# EAGLE design Board (EAGLE 6.6.0)
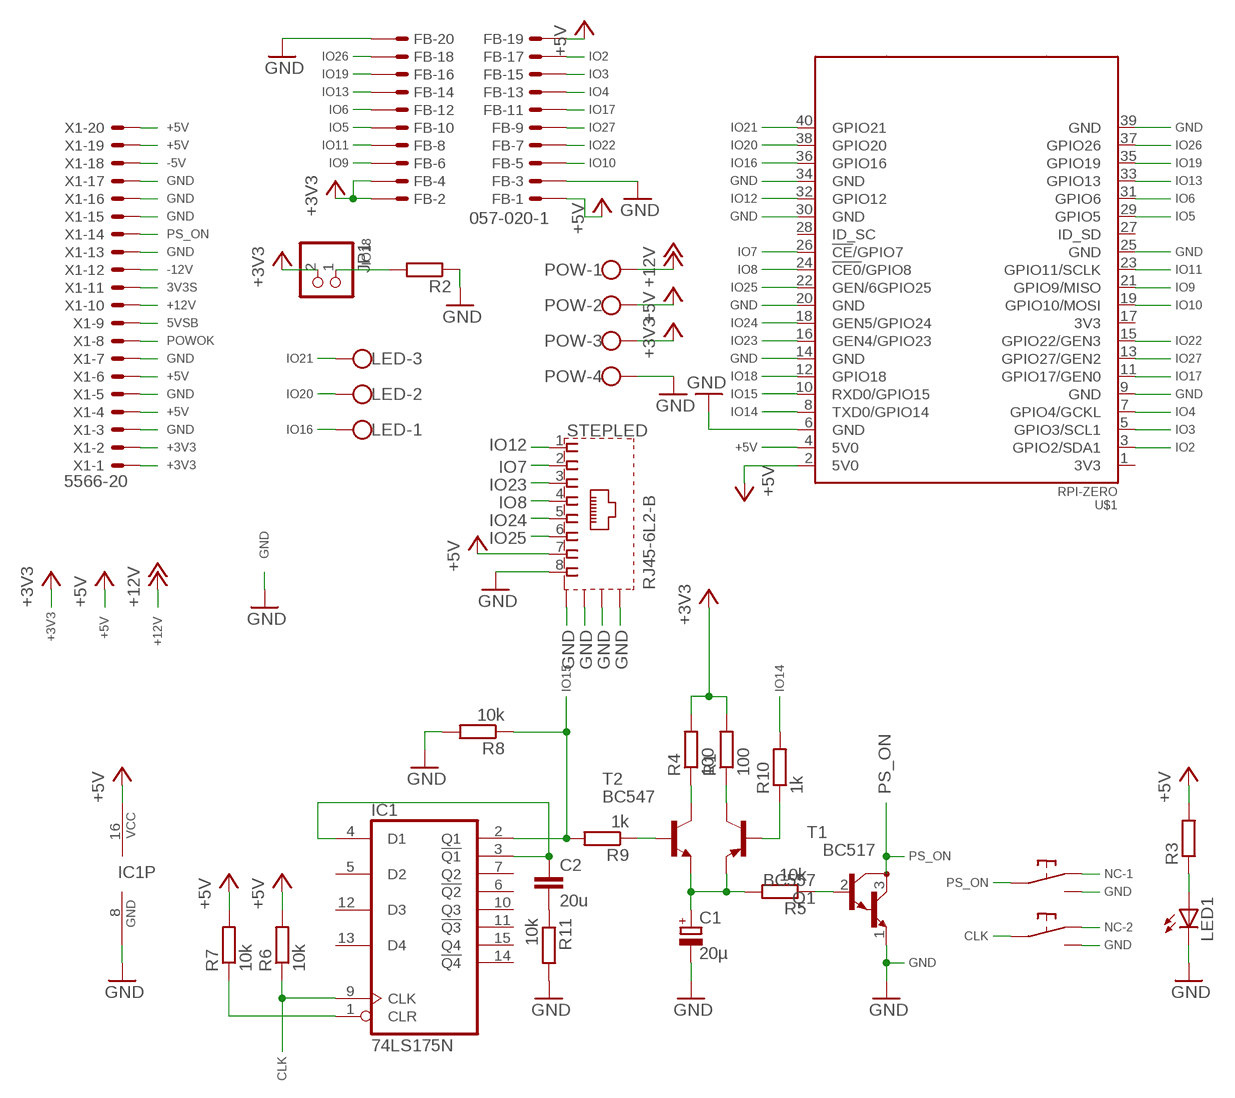
[diagram p0: schematic, sheet 1]

## Parts
C1  20µ  CPOL-EUE2,5-6E  [E2,5-6E]
C2  20u  C-EU050-024X044  [C050-024X044]
FB  057-020-1  [057-020-1]
IC1  74LS175N  [DIL16]
JP1  PINHD-1X2  [1X02]
LED  W237-103  [W237-103]
LED1  LED3MM  [LED3MM]
POW  W237-4  [W237-4]
Q1  BC557  [TO92]
R1  100  R-EU_0204/7  [0204/7]
R2  R-EU_0204/7  [0204/7]
R3  R-EU_0204/5  [0204/5]
R4  100  R-EU_0204/7  [0204/7]
R5  10k  R-EU_0204/7  [0204/7]
R6  10k  R-EU_0204/7  [0204/7]
R7  10k  R-EU_0204/7  [0204/7]
R8  10k  R-EU_0204/7  [0204/7]
R9  1k  R-EU_0204/7  [0204/7]
R10  1k  R-EU_0204/7  [0204/7]
R11  10k  R-EU_0204/7  [0204/7]
STEPLED  RJ45-6L2-B  [RJ45-SHIELD2]
T1  BC517  [TO92]
T2  BC547  [TO92]
U$1  RPI-ZERO  [RASPBERRYPI_BASTELSTUBE_V13_RASPI_BOARD_B+_FULL]
U$2  PC-SWITCH  [PC-SWITCH]
X1  5566-20  [5566-20]

## Nets
3V3S: X1.11
5VSB: X1.9
+3V3: FB.2 FB.4 JP1.2 POW.3 R1.2 R4.2 X1.1 X1.2
+5V: FB.1 FB.19 IC1.16(VCC) POW.2 R3.2 R6.2 R7.2 STEPLED.7 U$1.2(5V0) U$1.4(5V0) X1.4 X1.6 X1.19 X1.20
+12V: POW.1 X1.10
-5V: X1.18
-12V: X1.12
CLK: IC1.9(CLK) R6.1 U$2.COM$5
CLR: IC1.1(CLR) R7.1
GND: C1.- FB.3 FB.20 IC1.8(GND) LED1.K(C) POW.4 R2.1 R8.2 R11.2 STEPLED.8 STEPLED.S1(S) STEPLED.S2(S) STEPLED.S3(S) STEPLED.S4(S) T1.1(E) U$1.6(GND) U$1.9(GND) U$1.14(GND) U$1.20(GND) U$1.25(GND) U$1.30(GND) U$1.34(GND) U$1.39(GND) U$2.NO$3 U$2.NO$6 X1.3 X1.5 X1.7 X1.13 X1.15 X1.16 X1.17
IO2: FB.17 U$1.3(GPIO2/SDA1)
IO3: FB.15 U$1.5(GPIO3/SCL1)
IO4: FB.13 U$1.7(GPIO4/GCKL)
IO5: FB.10 U$1.29(GPIO5)
IO6: FB.12 U$1.31(GPIO6)
IO7: STEPLED.2 U$1.26(!CE!/GPIO7)
IO8: STEPLED.4 U$1.24(!CE0!/GPIO8)
IO9: FB.6 U$1.21(GPIO9/MISO)
IO10: FB.5 U$1.19(GPIO10/MOSI)
IO11: FB.8 U$1.23(GPIO11/SCLK)
IO12: STEPLED.1 U$1.32(GPIO12)
IO13: FB.14 U$1.33(GPIO13)
IO14: R10.2 U$1.8(TXD0/GPIO14)
IO15: IC1.2(Q1) R8.1 R9.2 U$1.10(RXD0/GPIO15)
IO16: LED.1 U$1.36(GPIO16)
IO17: FB.11 U$1.11(GPIO17/GEN0)
IO18: JP1.1 R2.2 U$1.12(GPIO18)
IO19: FB.16 U$1.35(GPIO19)
IO20: LED.2 U$1.38(GPIO20)
IO21: LED.3 U$1.40(GPIO21)
IO22: FB.7 U$1.15(GPIO22/GEN3)
IO23: STEPLED.3 U$1.16(GEN4/GPIO23)
IO24: STEPLED.5 U$1.18(GEN5/GPIO24)
IO25: STEPLED.6 U$1.22(GEN/6GPIO25)
IO26: FB.18 U$1.37(GPIO26)
IO27: FB.9 U$1.13(GPIO27/GEN2)
N$1: C2.2 R11.1
N$2: R4.1 T2.3(C)
N$3: Q1.3(C) R1.1
N$4: Q1.2(B) R10.1
N$19: LED1.A R3.1
N$20: C2.1 IC1.3(!Q1) IC1.4(D1)
N$21: R9.1 T2.2(B)
N$23: R5.1 T1.2(B)
N$24: C1.+ Q1.1(E) R5.2 T2.1(E)
NC-1: U$2.NC$1
NC-2: U$2.NC$4
POWOK: X1.8
PS_ON: T1.3(C) U$2.COM$2 X1.14
Unconnected: IC1.5(D2) IC1.6(!Q2) IC1.7(Q2) IC1.10(Q3) IC1.11(!Q3) IC1.12(D3) IC1.13(D4) IC1.14(!Q4) IC1.15(Q4) U$1.1(3V3) U$1.17(3V3) U$1.27(ID_SD) U$1.28(ID_SC)

## Library data of the parts
C1 = rcl:CPOL-EU: POLARIZED CAPACITOR, European symbol
C2 = rcl:C-EU: CAPACITOR, European symbol
FB = con-panduit:057-020-: CONNECTOR 20-pin series 057 contact pc board low profile headers; OC_FARNELL: unknown; OC_NEWARK: unknown
IC1 = 74xx-us:74*175: Qadruple D type FLIP FLOP, clear
JP1 = pinhead:PINHD-1X2: PIN HEADER
LED = con-wago-500:W237-103: WAGO SCREW CLAMP; MPN: 237-103; OC_FARNELL: unknown; OC_NEWARK: 18M7116
LED1 = led:LED: LED OSRAM: - CHIPLED LG R971, LG N971, LY N971, LG Q971, LY Q971, LO R971, LY R971 LH N974, LH R974 LS Q976, LO Q976, LY Q976 LO Q996 - Hyper CHIPLED LW Q18S LB Q993, LB Q99A, LB R99A - SideLED LS A670, LO A670, LY A670, LG A670, LP A670 LB A673, LV A673, LT A673, LW A673 LH A674 LY A675 LS A676, LA A676, LO A676, LY A676, LW A676 LS A679, LY A679, LG A679 - Hyper Micro SIDELED® LS Y876, LA Y876, LO Y876, LY Y876 LT Y87S - SmartLED LW L88C, LW L88S LB L89C, LB L89S, LG L890 LS L89K, LO L89K, LY L89K LS L896, LA L896, LO L896, LY L896 - TOPLED LS T670, LO T670, LY T670, LG T670, LP T670 LSG T670, LSP T670, LSY T670, LOP T670, LYG T670 LG T671, LOG T671, LSG T671 LB T673, LV T673, LT T673, LW T673 LH T674 LS T676, LA T676, LO T676, LY T676, LB T676, LH T676, LSB T676, LW T676 LB T67C, LV T67C, LT T67C, LS T67K, LO T67K, LY T67K, LW E67C LS E67B, LA E67B, LO E67B, LY E67B, LB E67C, LV E67C, LT E67C LW T67C LS T679, LY T679, LG T679 LS T770, LO T770, LY T770, LG T770, LP T770 LB T773, LV T773, LT T773, LW T773 LH T774 LS E675, LA E675, LY E675, LS T675 LS T776, LA T776, LO T776, LY T776, LB T776 LHGB T686 LT T68C, LB T68C - Hyper Mini TOPLED® LB M676 - Mini TOPLED Santana® LG M470 LS M47K, LO M47K, LY M47K Source: http://www.osram.convergy.de LUXEON: - LUMILED® LXK2-PW12-R00, LXK2-PW12-S00, LXK2-PW14-U00, LXK2-PW14-V00 LXK2-PM12-R00, LXK2-PM12-S00, LXK2-PM14-U00 LXK2-PE12-Q00, LXK2-PE12-R00, LXK2-PE12-S00, LXK2-PE14-T00, LXK2-PE14-U00 LXK2-PB12-K00, LXK2-PB12-L00, LXK2-PB12-M00, LXK2-PB14-N00, LXK2-PB14-P00, LXK2-PB14-Q00 LXK2-PR12-L00, LXK2-PR12-M00, LXK2-PR14-Q00, LXK2-PR14-R00 LXK2-PD12-Q00, LXK2-PD12-R00, LXK2-PD12-S00 LXK2-PH12-R00, LXK2-PH12-S00 LXK2-PL12-P00, LXK2-PL12-Q00, LXK2-PL12-R00 Source: www.luxeon.com KINGBRIGHT: KA-3528ASYC Source: www.kingbright.com
POW = con-wago-500:W237-4: WAGO SCREW CLAMP; OC_FARNELL: unknown; OC_NEWARK: unknown
Q1 = transistor-pnp:BC557: PNP Transistor
R1-R11 = resistor:R-EU_: RESISTOR, European symbol
STEPLED = con-tycoelectronics:RJ45*2: RJ45 Low Profile Shield Type 2 For all RJ45 L, LC, LCT and X Series Models Source: www.tycoelectronics.com .. ENG_DS_1654001_1099_RJ_L_0507.pdf; MPN: RJ45-6L2-B; OC_FARNELL: unknown; OC_NEWARK: 16R6096
T1 = transistor:BC517: NPN BIPOLAR DARLINGTON TRANSISTOR
T2 = transistor:BC547: NPN TRANSISTOR
U$1 = RPI-Zero:RPI-ZERO
U$2 = pc-switch:PC-SWITCH: PC-Switch with two electricly seperated pushbuttons
X1 = con-molex:5566-20: Mini FIT connector 20 pol ATX PC-Motherboard Power connector Source: http://www.molex.com; OC_FARNELL: unknown; OC_NEWARK: unknown

## Board
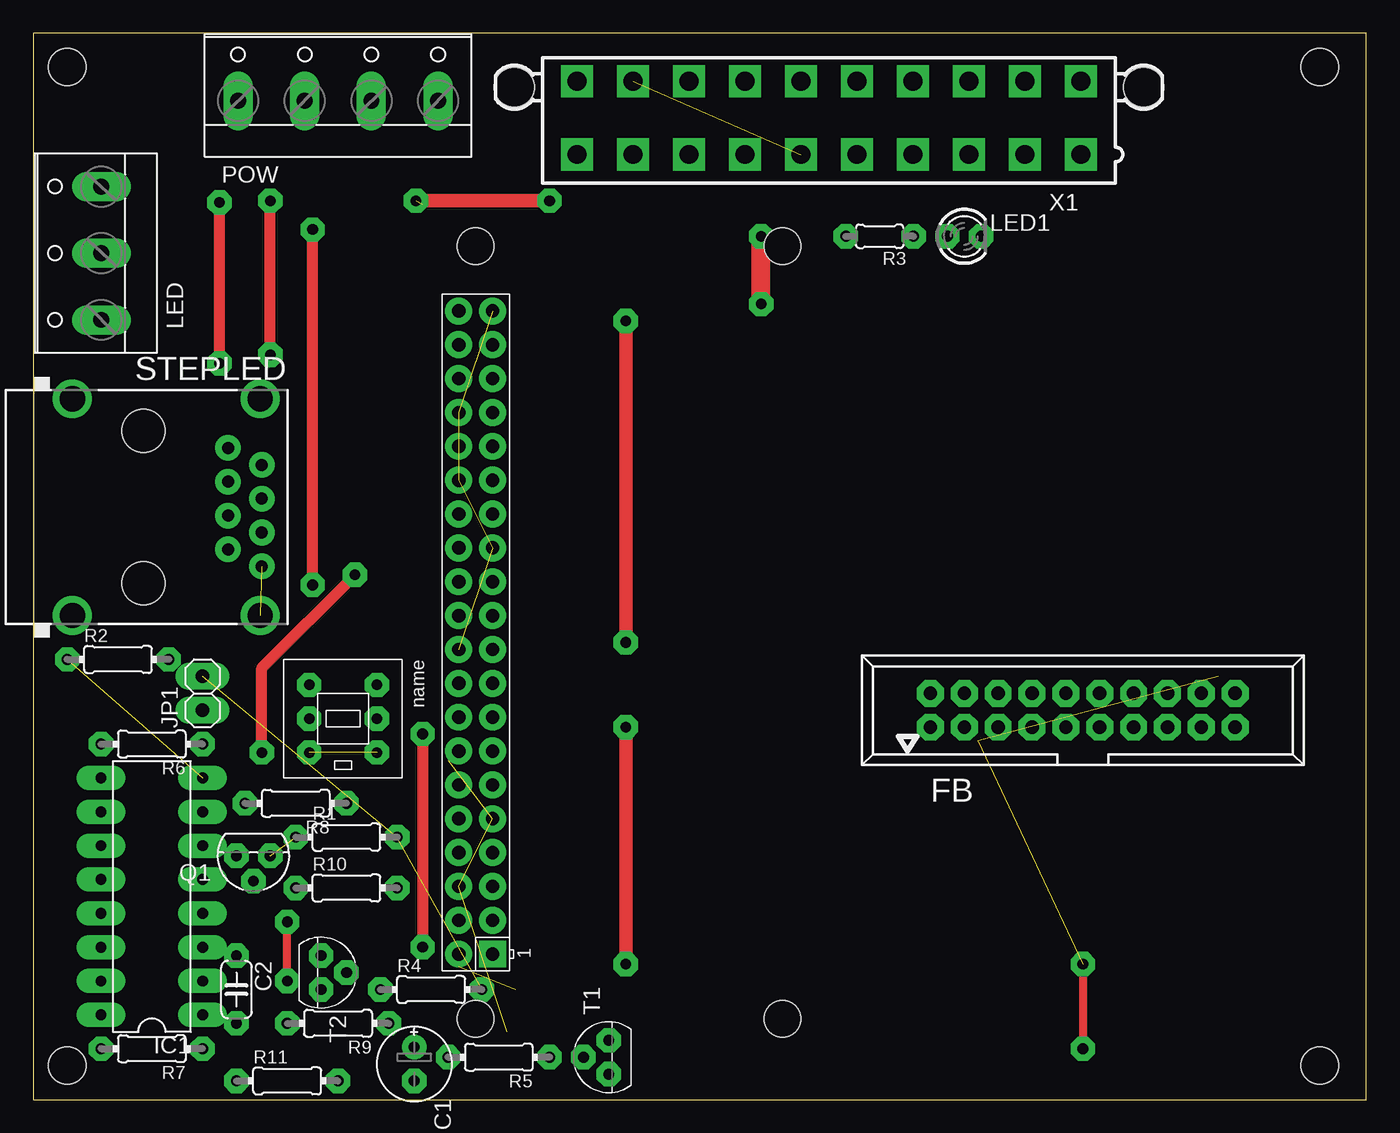
[diagram p1: board, top side]
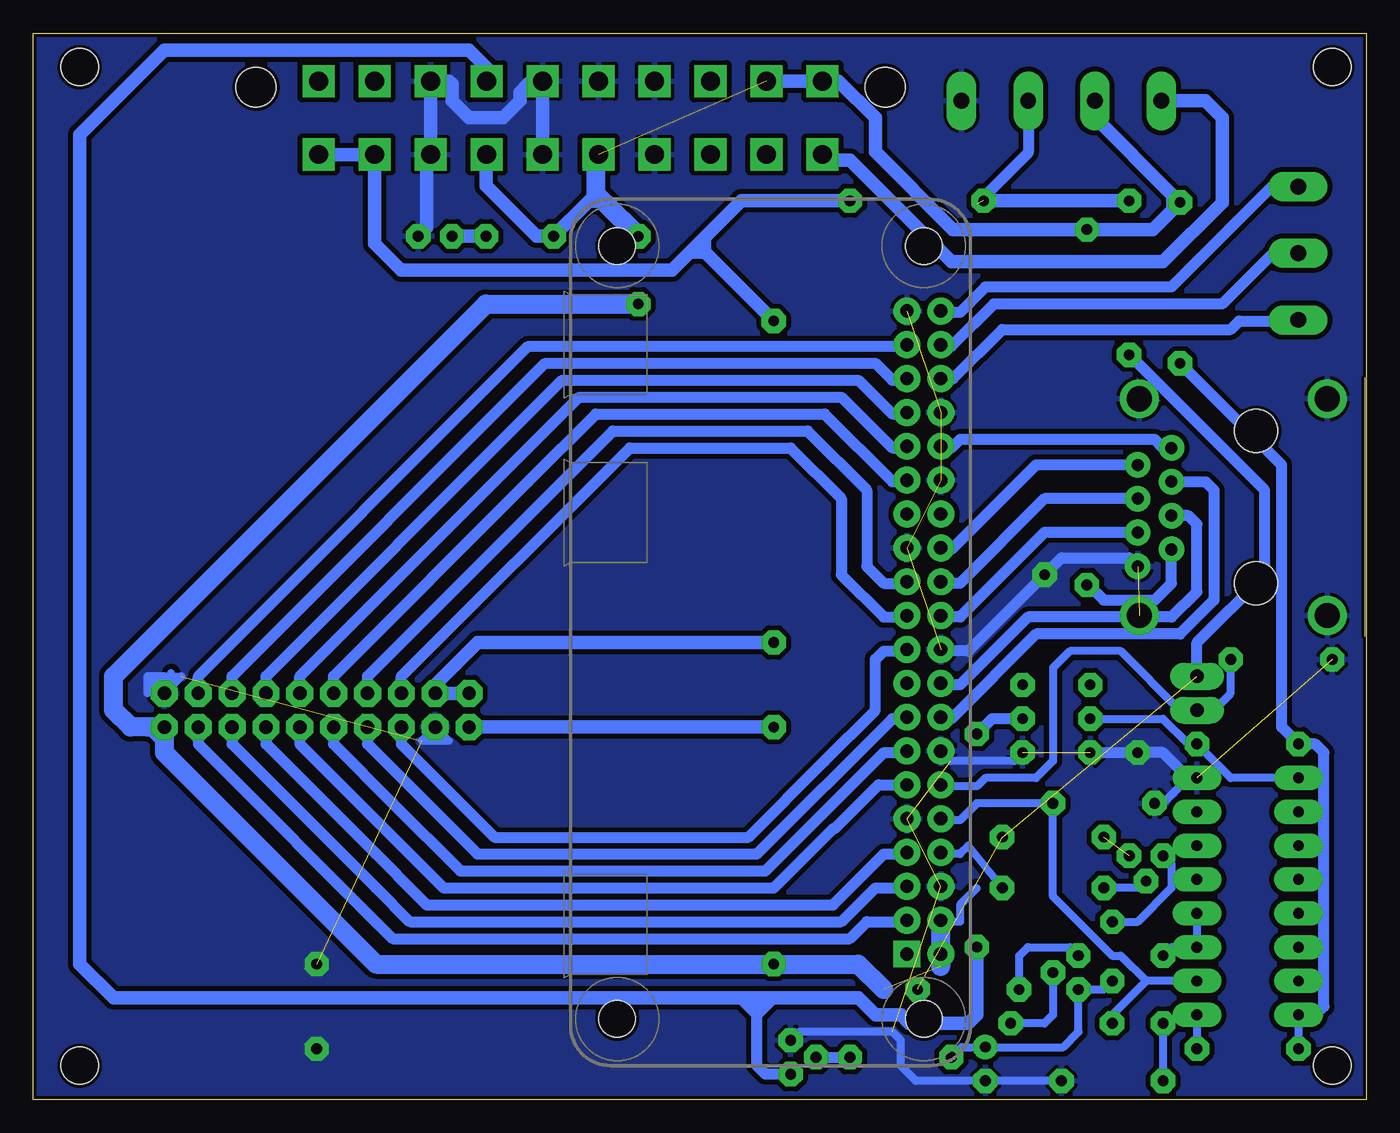
[diagram p2: board, bottom side, seen from below]

Size 100 x 80 mm. Coordinates in mm from the lower left corner, seen from the top.
Outline: 0,0 100,0 100,80 0,80 0,0
Copper layers (1*16): Top 0.035mm / dielectric 1.5mm / Bottom 0.035mm
Design rules "pl_design_rules": minimum track width 20mil, minimum drill 0.8mm, track to track 15mil, track to pad 20mil, pad to pad 20mil, via to via 20mil, smd to smd 8mil, copper to edge 10mil, drill to drill 8mil, minimum pad ring 20mil, minimum via ring 20mil, stop-mask expansion 4mil, vias tented up to drill 0mil, thermal gap 10mil
Holes 2.8 mm at 2.54,77.47 96.52,77.47 96.52,2.54 2.54,2.54

### Footprints (pad centres in the part's own frame; a part is rotated, then mirrored left to right if it is on the bottom)
E2,5-6E = drill 0.813 pad 1.575: + -1.27,0 | drill 0.813 pad 1.575 octagon: - 1.27,0
C050-024X044 = drill 0.813 octagon: 1 -2.54,0; 2 2.54,0
057-020-1 = drill 1 octagon: 1 -11.43,-1.27; 2 -11.43,1.27; 3 -8.89,-1.27; 4 -8.89,1.27; 5 -6.35,-1.27; 6 -6.35,1.27; 7 -3.81,-1.27; 8 -3.81,1.27; 9 -1.27,-1.27; 10 -1.27,1.27; 11 1.27,-1.27; 12 1.27,1.27; 13 3.81,-1.27; 14 3.81,1.27; 15 6.35,-1.27; 16 6.35,1.27; 17 8.89,-1.27; 18 8.89,1.27; 19 11.43,-1.27; 20 11.43,1.27
DIL16 = drill 0.813 long: 1 -8.89,-3.81; 2 -6.35,-3.81; 3 -3.81,-3.81; 4 -1.27,-3.81; 5 1.27,-3.81; 6 3.81,-3.81; 7 6.35,-3.81; 8 8.89,-3.81; 9 8.89,3.81; 10 6.35,3.81; 11 3.81,3.81; 12 1.27,3.81; 13 -1.27,3.81; 14 -3.81,3.81; 15 -6.35,3.81; 16 -8.89,3.81
1X02 = drill 1.016 long: 1 -1.27,0; 2 1.27,0
W237-103 = drill 1.194 long: 1 -5,-1.29; 2 0,-1.29; 3 5,-1.29
LED3MM = drill 0.813 octagon: A -1.27,0; K 1.27,0
W237-4 = drill 1.194 long: 1 -7.5,-1.27; 2 -2.5,-1.27; 3 2.5,-1.27; 4 7.5,-1.27
TO92 = drill 0.813 octagon: 1 1.27,0; 2 0,1.905; 3 -1.27,0
0204/7 = drill 0.813 octagon: 1 -3.81,0; 2 3.81,0
0204/5 = drill 0.813 octagon: 1 -2.54,0; 2 2.54,0
RJ45-SHIELD2 = drill 0.9 pad 1.4: 1 -4.445,6.35; 2 -3.175,8.89; 3 -1.905,6.35; 4 -0.635,8.89; 5 0.635,6.35; 6 1.905,8.89; 7 3.175,6.35; 8 4.445,8.89 | drill 1.9 pad 2.5: S1 -8.128,-5.33; S2 8.128,-5.33; S3 -8.128,8.76; S4 8.128,8.76 | hole 3.251: -5.715,0; 5.715,0
RASPBERRYPI_BASTELSTUBE_V13_RASPI_BOARD_B+_FULL = drill 1 pad 1.778 square: 1 8.37,25.23 | drill 1 pad 1.778: 2 8.37,27.77; 3 10.91,25.23; 4 10.91,27.77; 5 13.45,25.23; 6 13.45,27.77; 7 15.99,25.23; 8 15.99,27.77; 9 18.53,25.23; 10 18.53,27.77; 11 21.07,25.23; 12 21.07,27.77; 13 23.61,25.23; 14 23.61,27.77; 15 26.15,25.23; 16 26.15,27.77; 17 28.69,25.23; 18 28.69,27.77; 19 31.23,25.23; 20 31.23,27.77; 21 33.77,25.23; 22 33.77,27.77; 23 36.31,25.23; 24 36.31,27.77; 25 38.85,25.23; 26 38.85,27.77; 27 41.39,25.23; 28 41.39,27.77; 29 43.93,25.23; 30 43.93,27.77; 31 46.47,25.23; 32 46.47,27.77; 33 49.01,25.23; 34 49.01,27.77; 35 51.55,25.23; 36 51.55,27.77; 37 54.09,25.23; 38 54.09,27.77; 39 56.63,25.23; 40 56.63,27.77 | hole 2.75: 3.5,3.5; 3.5,26.5; 61.5,3.5; 61.5,26.5
PC-SWITCH = drill 0.8 octagon: COM$2 2.54,0; COM$5 2.54,-5.08; NC$1 0,0; NC$4 0,-5.08; NO$3 5.08,0; NO$6 5.08,-5.08
5566-20 = drill 1.4 square: 1 18.9,-2.75; 2 14.7,-2.75; 3 10.5,-2.75; 4 6.3,-2.75; 5 2.1,-2.75; 6 -2.1,-2.75; 7 -6.3,-2.75; 8 -10.5,-2.75; 9 -14.7,-2.75; 10 -18.9,-2.75; 11 18.9,2.75; 12 14.7,2.75; 13 10.5,2.75; 14 6.3,2.75; 15 2.1,2.75; 16 -2.1,2.75; 17 -6.3,2.75; 18 -10.5,2.75; 19 -14.7,2.75; 20 -18.9,2.75 | hole 3: 23.6,2.29; -23.6,2.29

### Placement (x,y rotation side)
C1  28.57,2.67 270 top
C2  15.24,8.26 270 top
FB  78.74,29.21 0 top
IC1  8.89,15.24 90 top
JP1  12.7,30.48 90 top
LED  3.81,63.5 90 top
LED1  69.85,64.77 0 top
POW  22.86,76.2 0 top
Q1  16.51,18.29 180 top
R1  23.5,19.68 0 top
R2  6.35,33.02 0 top
R3  63.5,64.77 180 top
R4  29.84,8.26 0 top
R5  34.92,3.17 180 top
R6  8.89,26.67 180 top
R7  8.89,3.81 180 top
R8  19.68,22.23 180 top
R9  22.86,5.71 180 top
R10  23.5,15.88 0 top
R11  19.05,1.4 0 top
STEPLED  8.26,44.45 270 top
T1  43.18,3.17 90 top
T2  21.59,9.53 270 top
U$1  59.69,2.54 90 top
U$2  25.78,31.11 270 top
X1  59.69,73.66 0 top

### Tracks (layer width: path | path; a pad name or v marks a point on that pad's centre or on a via)
+3V3  (via drill 0.8)  (3 unrouted)
  Top 0.813: v17.78,55.88 v17.78,67.44
  Top 1.016: v38.73,67.44 v28.7,67.44 | v44.45,34.29 v44.45,58.42
  Bottom 0.813: JP1.2 12.7,34.29 7.62,39.37 7.62,45.72 v17.78,55.88 | 50.8,63.5 49.53,63.5 49.53,64.77 | POW.3 25.36,71.03 29.21,67.18
  Bottom 1.016: 50.16,64.14 50.8,63.5 52.07,62.23 72.39,62.23 74.39,64.23 X1.2 X1.1 | 50.16,64.14 49.53,64.77 46.86,67.44 v38.73,67.44 | v44.45,34.29 66.67,34.29 69.85,31.11 FB.4 FB.2 | v44.45,58.42 49.53,63.5 50.16,64.14 | v17.78,67.44 v28.7,67.44
+5V  (via drill 0.8)  (2 unrouted)
  Top 0.813: v13.97,55.24 v13.97,67.31 | v20.95,38.61 v20.95,65.28
  Top 1.016: v44.45,27.94 v44.45,10.16
  Top 1.422: v54.61,59.69 v54.61,64.77
  Bottom 0.61: IC1.16 R7.2 | U$1.4 31.8,13.34 30.48,13.34 30.48,14.61 29.21,15.88
  Bottom 0.813: IC1.16 3.81,6.35 3.17,6.99 3.17,26.04 3.81,26.67 R6.2 6.35,27.94 6.35,47.62 v13.97,55.24 | 20.32,74.89 POW.2 | 91.44,27.94 90.17,26.67 | 57.15,67.31 58.42,67.31 | 14.61,67.94 14.61,66.67 | v20.95,38.61 20.83,38.61 19.68,37.47 15.88,37.47 14.61,38.73 STEPLED.7
  Bottom 1.016: 20.32,74.89 20.32,73.66 14.61,67.94 v13.97,67.31 14.61,66.67 16,65.28 v20.95,65.28 30.99,65.28 36.83,71.12 36.83,73.66 39.58,76.41 X1.20 X1.19 | X1.4 66.04,70.86 66.04,68.58 62.23,64.77 R3.2 58.42,67.31 57.78,67.94 | FB.1 v44.45,27.94
  Bottom 1.422: 57.78,70.72 57.78,67.94 57.15,67.31 v54.61,64.77 | U$1.4 U$1.2 31.92,9.99 | v54.61,59.69 66.04,59.69 93.98,31.75 93.98,29.21 92.71,27.94 91.44,27.94 FB.19 90.17,26.67 90.17,26.04 74.3,10.16 v44.45,10.16 38.1,10.16 36.2,8.26
  Bottom 1.676: 57.78,70.72 X1.6
+12V
  Bottom 1.016: POW.1 12.06,74.93 10.79,73.66 10.79,67.31 15.24,62.87 31.11,62.87 38.73,70.48 40.37,70.48 X1.10
CLK
  Bottom 0.61: U$2.COM$5 15.24,28.57 13.34,26.67 R6.1 10.16,24.13 IC1.9
CLR
  Bottom 0.61: IC1.1 R7.1
GND  (via drill 0.8)  (12 unrouted)
  Top 0.61: v78.74,10.16 v78.74,3.81
  Top 0.813: v17.14,26.04 17.14,32.38 v24.13,39.37
  Bottom 0.61: R11.2 C1.- 33.78,1.4 34.92,2.54 34.92,4.45 35.56,5.08 42.55,5.08 T1.1 | U$2.NO$3 26.42,25.4 31.17,25.4 U$1.14 | 13.34,24.13 15.24,22.23 R8.2 | 70.87,26.92 FB.3 68.83,26.92 70.61,26.92 | 91.44,31.75 FB.20 88.9,31.75 90.17,31.75 | 90.17,31.75 91.44,30.48 91.44,31.75 | 90.17,31.75 91.44,31.75
  Bottom 0.813: U$1.20 31.8,33.66 29.84,33.66 v24.13,39.37 22.86,40.64 17.78,40.64 STEPLED.8 | U$2.NO$6 v17.14,26.04 15.24,26.04 13.34,24.13 IC1.8
  Bottom 1.016: LED1.K 70.48,65.41 70.48,70.61 X1.3 X1.13 68.79,76.41 68.58,76.2 68.58,74.93 67.31,73.66 64.77,73.66 63.5,74.93 63.5,75.56 62.87,76.2 62,76.2 X1.15 X1.5
  pour Bottom: -0.64,80.64 -0.64,-1.91 100.97,-1.91 100.97,81.92 -0.64,81.92
IO2
  Bottom 0.813: FB.17 87.63,26.67 73.03,12.06 38.73,12.06 37.47,13.34 34.58,13.34 U$1.3
IO3
  Bottom 0.813: FB.15 85.09,26.67 74.3,15.88 71.75,13.34 39.37,13.34 36.83,15.88 34.58,15.88 U$1.5
IO4
  Bottom 0.813: FB.13 82.55,26.67 74.3,18.41 71.12,15.24 70.48,14.61 40.01,14.61 36.2,18.41 34.58,18.41 U$1.7
IO5
  Bottom 0.813: FB.10 77.47,31.75 62.87,46.35 57.78,51.44 40.64,51.44 35.56,46.35 34.58,46.35 U$1.29
IO6
  Bottom 0.813: FB.12 80.01,31.75 59.05,52.7 39.37,52.7 35.56,48.9 34.58,48.9 U$1.31
IO7
  Bottom 0.813: STEPLED.2 24.77,47.62 31.11,41.27 31.8,41.27 U$1.26
IO8
  Bottom 0.813: STEPLED.4 24.13,45.09 30.48,38.73 31.8,38.73 U$1.24
IO9
  Bottom 0.813: FB.6 72.39,31.75 55.24,48.9 43.18,48.9 39.37,45.09 39.37,39.37 36.2,36.2 34.58,36.2 U$1.21
IO10
  Bottom 0.813: FB.5 72.39,26.67 71.12,25.4 65.41,19.68 46.35,19.68 40.64,25.4 36.83,29.21 36.83,33.02 36.2,33.66 34.58,33.66 U$1.19
IO11
  Bottom 0.813: FB.8 74.93,31.75 56.52,50.16 41.91,50.16 37.47,45.72 37.47,40.01 36.2,38.73 34.58,38.73 U$1.23
IO12
  Bottom 0.813: STEPLED.1 15.24,48.9 15.88,49.53 30.48,49.53 31.11,48.9 31.8,48.9 U$1.32
IO13
  Bottom 0.813: FB.14 82.55,31.75 62.87,51.44 60.33,53.98 38.1,53.98 35.56,51.44 34.58,51.44 U$1.33
IO14
  Bottom 0.61: R10.2 29.84,19.05 30.48,18.41 31.8,18.41 U$1.8
IO15
  Bottom 0.61: IC1.2 16.51,8.89 | R9.2 19.05,6.35 16.51,8.89 | U$1.10 31.8,20.95 30.48,20.95 29.21,22.23 R8.1 23.5,15.24 19.05,10.79 18.41,10.79 16.51,8.89
IO16
  Bottom 0.813: U$1.36 31,54.09 27.3,57.78 10.16,57.78 9.53,58.42 5.18,58.42 LED.1
IO17
  Bottom 0.813: FB.11 80.01,26.67 73.66,20.32 69.85,16.51 69.22,15.88 44.45,15.88 40.01,20.32 39.88,20.32 36.59,23.61 U$1.11
IO18
  Bottom 0.61: R2.2 10.16,30.48 11.43,29.21 JP1.1 13.97,29.21 18.41,33.66 22.23,33.66 23.5,32.38 23.5,25.4 24.77,24.13 28.57,24.13 29.21,23.5 31.8,23.5 U$1.12
IO19
  Bottom 0.813: FB.16 85.09,31.75 61.59,55.24 36.83,55.24 35.56,53.98 34.58,53.98 U$1.35
IO20
  Bottom 0.813: LED.2 6.99,63.5 10.79,59.69 27.94,59.69 31.11,56.52 31.8,56.52 U$1.38
IO21
  Bottom 0.813: LED.3 7.07,68.5 14.61,60.96 28.57,60.96 30.48,59.05 31.8,59.05 U$1.40
IO22
  Bottom 0.813: FB.7 74.93,26.67 66.67,18.41 45.72,18.41 35.56,28.57 34.58,28.57 U$1.15
IO23
  Bottom 0.813: STEPLED.3 12.06,46.35 11.43,45.72 11.43,37.47 13.97,34.92 24.77,34.92 31.11,28.57 31.8,28.57 U$1.16
IO24
  Bottom 0.813: U$1.18 31.8,31.11 30.48,31.11 25.4,36.2 14.61,36.2 12.7,38.1 12.7,43.18 13.34,43.81 STEPLED.5
IO25
  Bottom 0.813: STEPLED.6 24.13,42.55 30.48,36.2 31.8,36.2 U$1.22
IO26
  Bottom 0.813: FB.18 87.63,31.75 62.87,56.52 34.58,56.52 U$1.37
IO27
  Bottom 0.813: FB.9 77.47,26.67 73.03,22.23 67.94,17.14 45.09,17.14 40.01,22.23 36.2,26.04 34.58,26.04 U$1.13
N$1
  Bottom 0.61: C2.2 R11.1
N$2
  Bottom 0.61: R4.1 26.04,10.79 25.4,11.43 22.23,11.43 T2.3
N$3  (1 unrouted)
N$4
  Bottom 0.61: Q1.2 17.02,15.88 R10.1
N$5
  Bottom 0.61: 89.66,32 89.66,31.24
N$19
  Bottom 1.016: R3.1 LED1.A
N$20
  Bottom 0.61: C2.1 14.61,11.43 IC1.3 IC1.4
N$21
  Bottom 0.61: T2.2 23.5,6.35 24.13,5.71 R9.1
N$23
  Bottom 0.813: T1.2 R5.1
N$24  (via drill 0.8)
  Top 0.61: v19.05,8.89 v19.05,13.34
  Bottom 0.61: R5.2 30.35,3.94 C1.+ 22.73,3.94 21.59,5.08 T2.1 19.68,8.26 v19.05,8.89 | v19.05,13.34 17.14,13.34 14.61,15.88 14.61,17.65 Q1.1
PS_ON  (via drill 0.8)
  Top 0.813: v29.21,27.43 v29.21,11.43
  Bottom 0.813: U$2.COM$2 28.07,28.57 v29.21,27.43 | T1.3 45.09,1.91 45.72,2.54 45.72,6.35 | 45.72,6.35 46.99,7.62 | 45.72,6.35 44.45,7.62 | 45.72,6.35 45.72,7.62
  Bottom 1.016: X1.14 65.99,77.42 67.31,78.74 90.17,78.74 96.52,72.39 96.52,10.16 93.98,7.62 46.99,7.62 45.72,7.62 44.45,7.62 38.1,7.62 36.83,6.35 34.92,6.35 34.29,5.71 29.84,5.71 29.21,6.35 v29.21,11.43